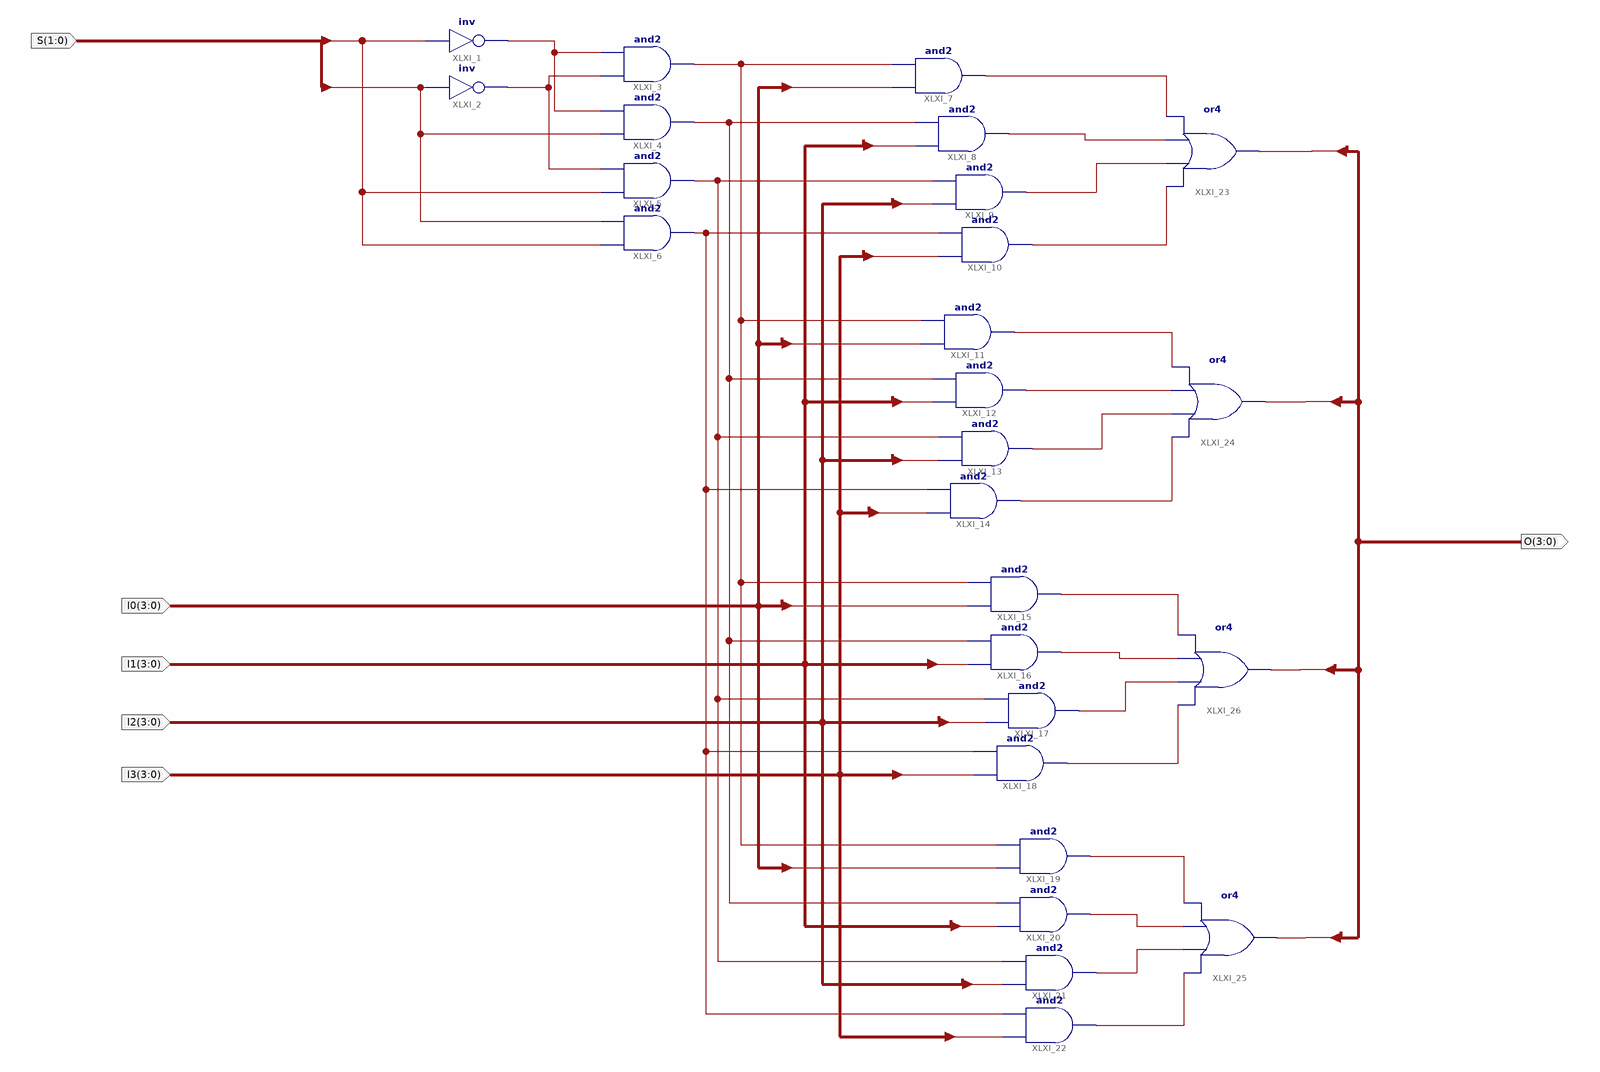
[diagram p0: schematic sheet 1]
// Xilinx ISE schematic MUX4to1b4.sch (kintex7) as structural Verilog: 26 symbols, 6 ports
module MUX4to1b4 (
  input  [1:0] S,
  input  [3:0] I0,
  input  [3:0] I1,
  input  [3:0] I2,
  input  [3:0] I3,
  output [3:0] O
);

  wire XLXN_4, XLXN_6, XLXN_12, XLXN_13, XLXN_14, XLXN_15, XLXN_59, XLXN_60, XLXN_61, XLXN_62, XLXN_63,
       XLXN_64, XLXN_65, XLXN_66, XLXN_67, XLXN_68, XLXN_69, XLXN_70, XLXN_71, XLXN_73, XLXN_74, XLXN_75;

  not XLXI_1 (XLXN_4, S[1]);
  not XLXI_2 (XLXN_6, S[0]);
  and XLXI_3 (XLXN_12, XLXN_6, XLXN_4);
  and XLXI_4 (XLXN_13, S[0], XLXN_4);
  and XLXI_5 (XLXN_14, S[1], XLXN_6);
  and XLXI_6 (XLXN_15, S[1], S[0]);
  and XLXI_7 (XLXN_59, I0[0], XLXN_12);
  and XLXI_8 (XLXN_60, I1[0], XLXN_13);
  and XLXI_9 (XLXN_61, I2[0], XLXN_14);
  and XLXI_10 (XLXN_62, I3[0], XLXN_15);
  and XLXI_11 (XLXN_63, I0[1], XLXN_12);
  and XLXI_12 (XLXN_64, I1[1], XLXN_13);
  and XLXI_13 (XLXN_65, I2[1], XLXN_14);
  and XLXI_14 (XLXN_66, I3[1], XLXN_15);
  and XLXI_15 (XLXN_67, I0[2], XLXN_12);
  and XLXI_16 (XLXN_68, I1[2], XLXN_13);
  and XLXI_17 (XLXN_69, I2[2], XLXN_14);
  and XLXI_18 (XLXN_70, I3[2], XLXN_15);
  and XLXI_19 (XLXN_71, I0[3], XLXN_12);
  and XLXI_20 (XLXN_73, I1[3], XLXN_13);
  and XLXI_21 (XLXN_74, I2[3], XLXN_14);
  and XLXI_22 (XLXN_75, I3[3], XLXN_15);
  or XLXI_23 (O[0], XLXN_62, XLXN_61, XLXN_60, XLXN_59);
  or XLXI_24 (O[1], XLXN_66, XLXN_65, XLXN_64, XLXN_63);
  or XLXI_25 (O[3], XLXN_75, XLXN_74, XLXN_73, XLXN_71);
  or XLXI_26 (O[2], XLXN_70, XLXN_69, XLXN_68, XLXN_67);
endmodule
